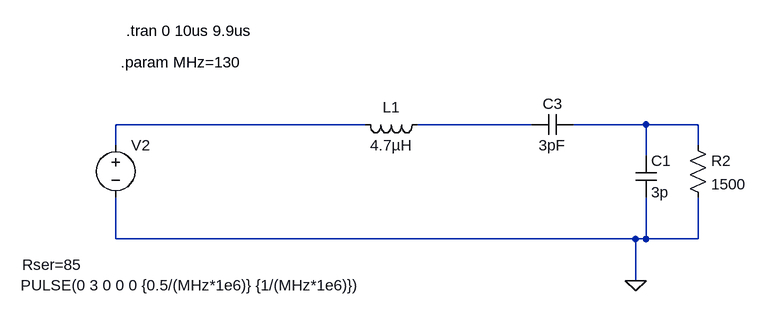
[diagram p0: schematic LO Filter.asc]
LO Filter.asc, the LTspice schematic file:
Version 4.1
SHEET 1 1112 680
WIRE 48 96 -336 96
WIRE 304 96 128 96
WIRE 480 96 368 96
WIRE 560 96 480 96
WIRE -336 128 -336 96
WIRE 560 128 560 96
WIRE 480 144 480 96
WIRE -336 272 -336 208
WIRE 464 272 -336 272
WIRE 480 272 480 208
WIRE 480 272 464 272
WIRE 560 272 560 208
WIRE 560 272 480 272
WIRE 464 336 464 272
FLAG 464 336 0
SYMBOL ind 144 80 R90
WINDOW 0 5 56 VBottom 2
WINDOW 3 32 56 VTop 2
SYMATTR InstName L1
SYMATTR Value 4.7µH
SYMATTR SpiceLine Rser=1
SYMBOL res 544 112 R0
SYMATTR InstName R2
SYMATTR Value 1500
SYMBOL voltage -336 112 R0
WINDOW 3 -146 231 Left 2
WINDOW 123 -62 93 Left 2
WINDOW 39 -144 200 Left 2
SYMATTR Value PULSE(0 3 0 0 0 {0.5/(MHz*1e6)} {1/(MHz*1e6)})
SYMATTR SpiceLine Rser=85
SYMATTR InstName V2
SYMBOL cap 464 144 R0
SYMATTR InstName C1
SYMATTR Value 3p
SYMBOL cap 368 80 R90
WINDOW 0 0 32 VBottom 2
WINDOW 3 32 32 VTop 2
SYMATTR InstName C3
SYMATTR Value 3pF
SYMATTR SpiceLine Rser=1
TEXT -320 -48 Left 2 !.tran 0 10us 9.9us
TEXT -328 0 Left 2 !.param MHz=130

The netlist it stands for:
* LO Filter.asc
L1 N002 N001 4.7µH Rser=1
R2 N003 0 1500
V2 N001 0 PULSE(0 3 0 0 0 {0.5/(MHz*1e6)} {1/(MHz*1e6)}) Rser=85
C1 N003 0 3p
C3 N003 N002 3pF Rser=1
.tran 0 10us 9.9us
.param MHz=130
.backanno
.end